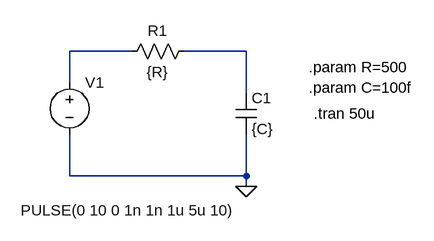
[diagram p0: schematic example_circuit_generated.asc]
example_circuit_generated.asc, the LTspice schematic file:
Version 4
SHEET 1 880 680
WIRE 96 64 0 64
WIRE 272 64 176 64
WIRE 0 112 0 64
WIRE 272 128 272 64
WIRE 0 256 0 192
WIRE 272 256 272 192
WIRE 272 256 0 256
WIRE 272 272 272 256
FLAG 272 272 0
SYMBOL voltage 0 96 R0
WINDOW 3 -75 213 Left 2
WINDOW 123 0 0 Left 2
WINDOW 39 0 0 Left 2
SYMATTR InstName V1
SYMATTR Value PULSE(0 10 0 1n 1n 1u 5u 10)
SYMBOL res 80 80 R270
WINDOW 0 32 56 VTop 2
WINDOW 3 0 56 VBottom 2
SYMATTR InstName R1
SYMATTR Value {R}
SYMBOL cap 256 128 R0
SYMATTR InstName C1
SYMATTR Value {C}
TEXT 368 88 Left 2 !.param R=500
TEXT 368 120 Left 2 !.param C=100f
TEXT 376 160 Left 2 !.tran 50u

The netlist it stands for:
* example_circuit_generated.asc
V1 N001 0 PULSE(0 10 0 1n 1n 1u 5u 10)
R1 N001 N002 {R}
C1 N002 0 {C}
.param R=500
.param C=100f
.tran 50u
.backanno
.end